# Altium schematic sheet POWER.SchDoc
size A2
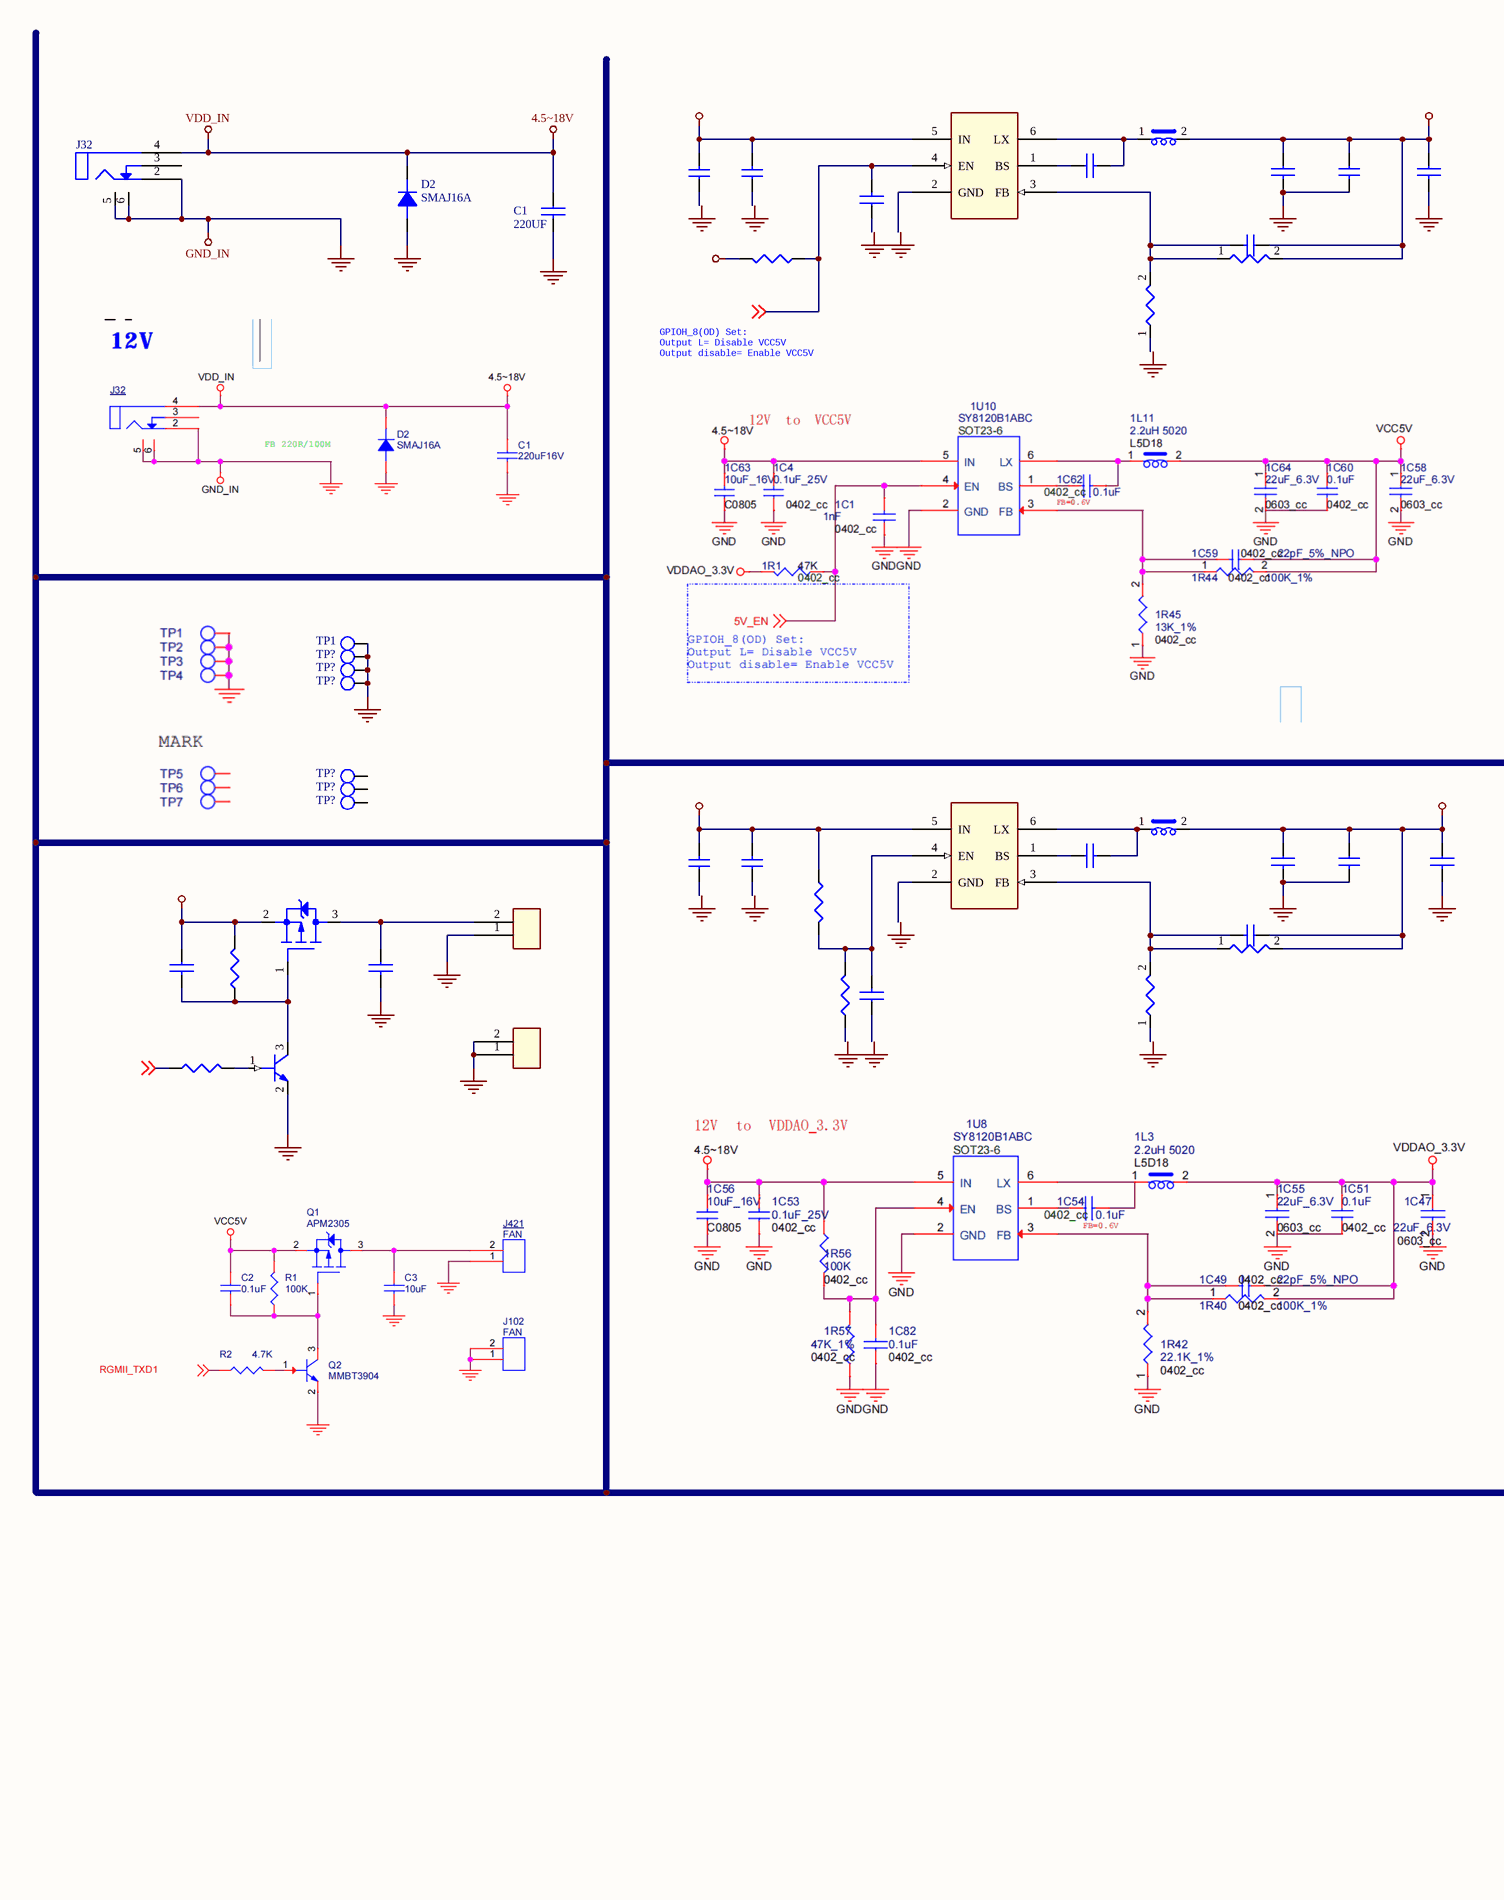
[diagram p0: POWER.SchDoc, left]
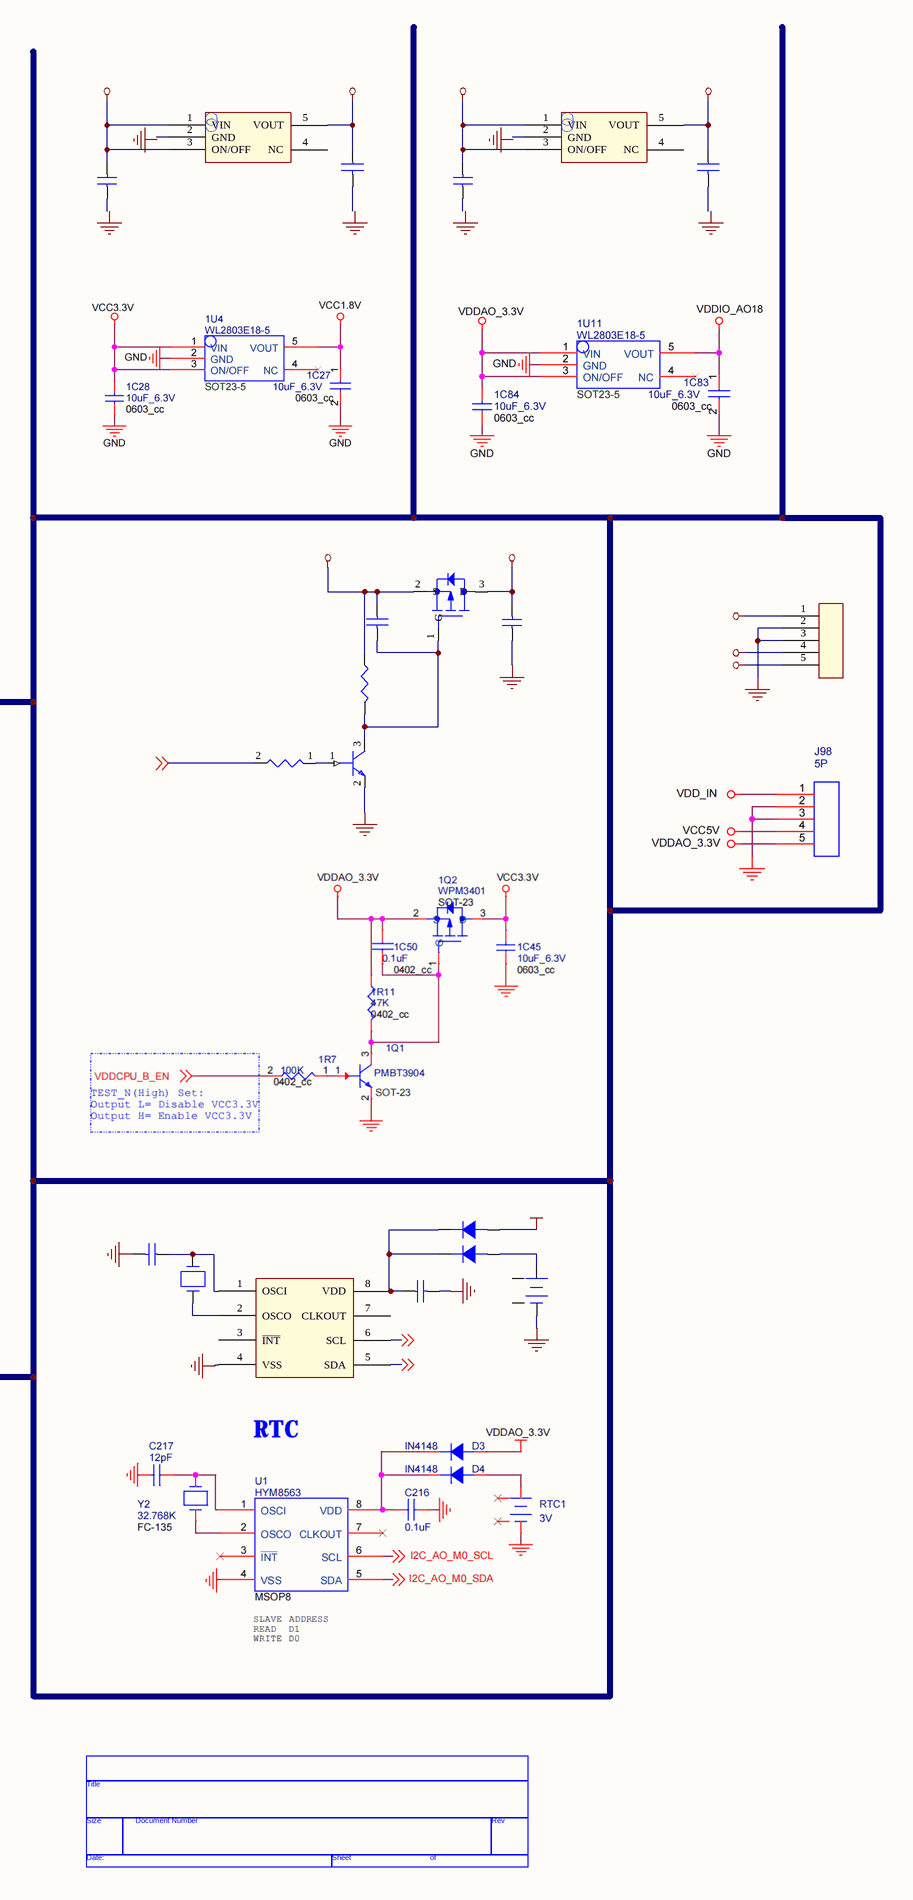
[diagram p1: POWER.SchDoc, right]

## Parts
(Parts that share a designator on the sheet are numbered #1, #2 ... from top to bottom, then left to right.)
*?  TitleBlock0  (value not drawn)  (graphical)
?#1  (no value)  [SOT23-6L]
?#2  (no value)
?#3  (no value)  [SOT-23-5]
?#4  (no value)  [SOT-23-5]
?#5  (no value)
?#6  (no value)  [C0402]
?#7  (no value)  [0603C]
?#8  (no value)  [C0402]
?#9  (no value)  [0603C]
?#10  (no value)  [0603C]
?#11  (no value)  [C0402]
?#12  (no value)  [C0402]
?#13  (no value)  [C0805]
?#14  (no value)  [0603C]
?#15  (no value)  [0603C]
?#16  (no value)  [0603C]
?#17  RTC1  (value not drawn)
?#18  (no value)
?#19  (no value)
?#20  (no value)
?#21  (no value)
?#22  (no value)  [0603C]
?#23  RTC1  [R0603/SMD]  (value not drawn)
?#24  (no value)  [SOT23-6L]
?#25  (no value)
?#26  (no value)
?#27  (no value)
?#28  (no value)
?#29  (no value)  [C0402]
?#30  1C58  [0603C]  (value not drawn)
?#31  (no value)  [C0402]
?#32  (no value)  [0603C]
?#33  (no value)  [0603C]
?#34  (no value)  [R0603/SMD]
?#35  (no value)  [0603C]
?#36  (no value)
?#37  (no value)  [R0603/SMD]
?#38  (no value)
?#39  (no value)
C1  220UF
C?#1  1C58  (value not drawn)
C?#2  (no value)  [C0402]
C?#3  (no value)  [C0402]
C?#4  (no value)  [C0402]
D2  SMAJ16A
D?#1  (no value)
D?#2  (no value)
J32  (no value)
J?#1  (no value)
J?#2  (no value)
J?#3  (no value)
Q?#1  (no value)
Q?#2  (no value)
R?#1  (no value)
R?#2  (no value)
RTC?  (no value)
TP1  (no value)
TP?#1  (no value)
TP?#2  (no value)
TP?#3  (no value)
TP?#4  (no value)
TP?#5  (no value)
TP?#6  (no value)
U?  (no value)
Y?  (no value)

## Nets
4.5~18V: C1.1 D2.2(K) J32.4  [also labelled VDD_IN]
GND_IN: ?#1.4(EN) ?#1.5(IN) ?#2.2 ?#3.1(VIN) ?#3.3(ON/OFF) ?#3.5(VOUT) ?#4.1(VIN) ?#4.3(ON/OFF) ?#4.5(VOUT) ?#6.1 ?#6.2 ?#7.1 ?#7.2 ?#8.1 ?#8.2 ?#9.2 ?#10.2 ?#11.1 ?#12.1 ?#13.2 ?#14.2 ?#15.2 ?#16.1 ?#17.1 ?#17.2 ?#18.2 ?#20.1 ?#21.2(S) ?#21.3(D) ?#22.1 ?#22.2 ?#23.2 ?#24.5(IN) ?#25.2 ?#26.2(EMITTER) ?#28.2 ?#29.1 ?#29.2 ?#30.1 ?#30.2 ?#31.1 ?#31.2 ?#32.2 ?#33.2 ?#34.2 ?#35.1 ?#36.2 C1.2 C?#1.1 C?#2.2 C?#3.2 C?#4.2 D2.1(A) D?#1.1(A) J32.2 J32.5 J32.6 J?#1.1 J?#1.2 J?#1.3 J?#1.4 J?#1.5 J?#2.1 J?#3.1 J?#3.2 Q?#1.2(S) Q?#2.2(EMITTER) R?#1.2 R?#2.1 RTC?.2(-) TP1.1(TP) TP?#1.1(TP) TP?#2.1(TP) TP?#3.1(TP) U?.4(VSS) U?.5(SDA) U?.6(SCL) ; off-sheet 
Net?#1_1: ?#1.1(BS) ?#5.1
Net?#1_3: ?#1.3(FB) ?#16.2 ?#18.1 ?#19.2
Net?#1_6: ?#1.6(LX) ?#2.1 ?#5.2
Net?#20_2: ?#20.2 ?#21.1(G) ?#23.1 ?#26.3(COLLECTOR)
Net?#24_1: ?#24.1(BS) ?#27.1
Net?#24_3: ?#24.3(FB) ?#35.2 ?#36.1 ?#39.2
Net?#24_4: ?#24.4(EN) ?#34.1 ?#37.1 ?#38.2
Net?#24_6: ?#24.6(LX) ?#25.1 ?#27.2
Net?#26_1: ?#26.1(BASE) ?#28.1
NetC?#1_2: C?#1.2 Q?#1.1(G) Q?#2.3(COLLECT) R?#1.1
NetC?#2_1: C?#2.1 J?#2.2 Q?#1.3(D)
NetC?#3_1: C?#3.1 U?.1(OSCI) Y?.1
NetC?#4_1: C?#4.1 D?#1.2(K) D?#2.2(K) U?.8(VDD)
NetD?#2_1: D?#2.1(A) RTC?.1(+)
NetQ?#2_1: Q?#2.1(BASE) R?#2.2
NetU?_2: U?.2(OSCO) Y?.2

Not connected (* = marked no-connect by the designer): ?#1 2(GND); ?#3 2(GND) 4(NC); ?#4 2(GND) 4(NC); ?#9 1; ?#10 1; ?#11 2; ?#12 2; ?#13 1; ?#14 1; ?#15 1; ?#19 1; ?#24 2(GND); ?#32 1; ?#33 1; ?#37 2; ?#38 1; ?#39 1; J32 3; RTC? 3 4; TP?#4 1(TP); TP?#5 1(TP); TP?#6 1(TP); U? 3(~{INT}) 7(CLKOUT)

## Notes on the sheet
- GPIOH_8(OD) Set:
  Output L= Disable VCC5V
  Output disable= Enable VCC5V
- (in symbol TitleBlock0) Title; Size; Document Number; Rev; Date:; Sheet; of

## Library data of the parts
?#1 ?#24 = SY81XX
?#2 = Indu
?#3 ?#4 = WL2003E
?#5 ?#27 C?#1 = CAP NP_9
?#6 ?#8 ?#11 ?#12 ?#29 ?#31 C?#2-C?#4 = CAP NP
?#7 ?#9 ?#10 ?#14-?#16 ?#22 ?#30 ?#32 ?#33 ?#35 = capnp
?#13 = C0805
?#17 = RESISTOR
?#18 ?#19 ?#28 ?#36 ?#39 = RES-V
?#20 ?#38 = CAP NP_7
?#21 = P-MOSFET
?#23 ?#34 ?#37 = R0603_0
?#25 = In
?#26 = npn
C1 = CAP
D2 D?#1 D?#2 = DIODE
J32 = CONN JACK PWR_0
J?#1 = CON4_1
J?#2 J?#3 = CON2
Q?#1 = APM2301
Q?#2 = NPN_1
R?#1 = RESISTOR_0
R?#2 = R
RTC? = BATTERY_5
TP1 TP?#1-TP?#6 = T POINT R
U? = RTC
Y? = CRYSTAL-4P_1